# EAGLE design oktosema (EAGLE 6.5.0)
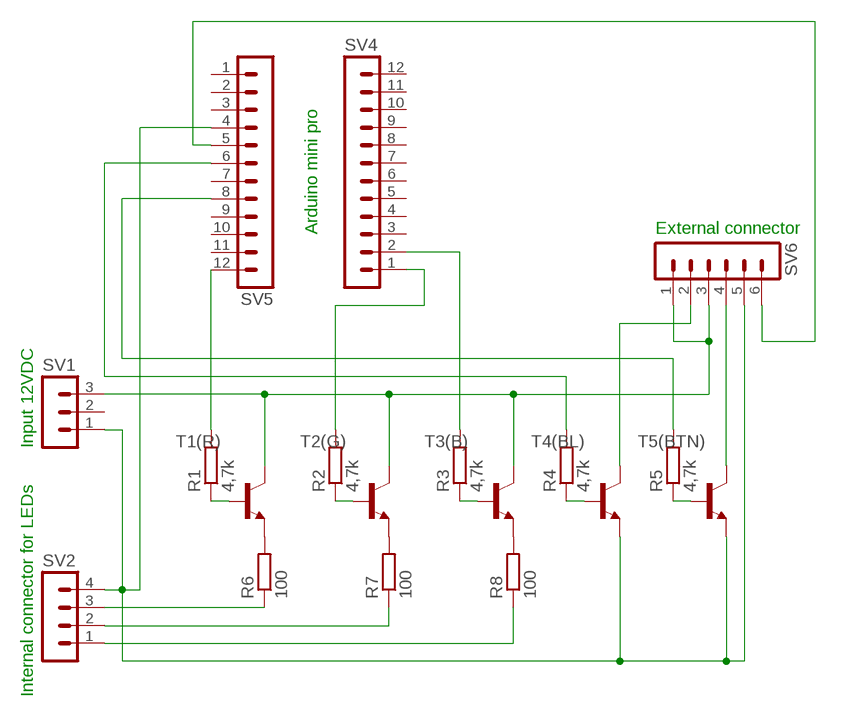
[diagram p0: schematic, sheet 1]

## Parts
R1  4,7k  R-EU_0204/7  [0204/7]
R2  4,7k  R-EU_0204/7  [0204/7]
R3  4,7k  R-EU_0204/7  [0204/7]
R4  4,7k  R-EU_0204/7  [0204/7]
R5  4,7k  R-EU_0204/7  [0204/7]
R6  100  R-EU_0204/7  [0204/7]
R7  100  R-EU_0204/7  [0204/7]
R8  100  R-EU_0204/7  [0204/7]
SV1  MA03-1  [MA03-1]
SV2  MA04-1  [MA04-1]
SV4  MA12-1  [MA12-1]
SV5  MA12-1  [MA12-1]
SV6  MA06-1  [MA06-1]
T1(R)  BC337-25-NPN-TO92-CBE  [TO92-CBE]
T2(G)  BC337-25-NPN-TO92-CBE  [TO92-CBE]
T3(B)  BC337-25-NPN-TO92-CBE  [TO92-CBE]
T4(BL)  BC337-25-NPN-TO92-CBE  [TO92-CBE]
T5(BTN)  BC337-25-NPN-TO92-CBE  [TO92-CBE]

## Nets
N$1: R1.1 T1(R).B
N$2: R2.1 T2(G).B
N$3: R3.1 T3(B).B
N$4: R4.1 T4(BL).B
N$5: R5.1 T5(BTN).B
N$6: R1.2 SV5.12
N$7: R2.2 SV4.1
N$8: R3.2 SV4.2
N$9: R4.2 SV5.6
N$10: R5.2 SV5.8
N$11: SV1.3 SV6.1 SV6.3 T1(R).C T2(G).C T3(B).C
N$12: R6.2 T1(R).E
N$13: R7.2 T2(G).E
N$14: R8.2 T3(B).E
N$15: SV6.4 T5(BTN).C
N$16: R8.1 SV2.1
N$18: R6.1 SV2.3
N$19: R7.1 SV2.2
N$20: SV6.2 T4(BL).C
N$21: SV5.5 SV6.6
N$22: SV1.1 SV2.4 SV5.4 SV6.5 T4(BL).E T5(BTN).E
Unconnected: SV1.2 SV4.3 SV4.4 SV4.5 SV4.6 SV4.7 SV4.8 SV4.9 SV4.10 SV4.11 SV4.12 SV5.1 SV5.2 SV5.3 SV5.7 SV5.9 SV5.10 SV5.11

## Notes on the sheet
- Arduino mini pro | External connector
- Input 12VDC
- Internal connector for LEDs

## Library data of the parts
R1-R8 = resistor:R-EU_: RESISTOR, European symbol; OC_NEWARK: unknown
SV1 = con-lstb:MA03-1: PIN HEADER; OC_FARNELL: unknown; OC_NEWARK: unknown
SV2 = con-lstb:MA04-1: PIN HEADER; OC_FARNELL: unknown; OC_NEWARK: unknown
SV4 SV5 = con-lstb:MA12-1: PIN HEADER; OC_FARNELL: unknown; OC_NEWARK: unknown
SV6 = con-lstb:MA06-1: PIN HEADER; OC_FARNELL: unknown; OC_NEWARK: unknown
T1(R) T2(G) T3(B) T4(BL) T5(BTN) = transistor:*-NPN-: NPN Transistror BF959 corrected 2008.03.06; OC_NEWARK: unknown

## Board
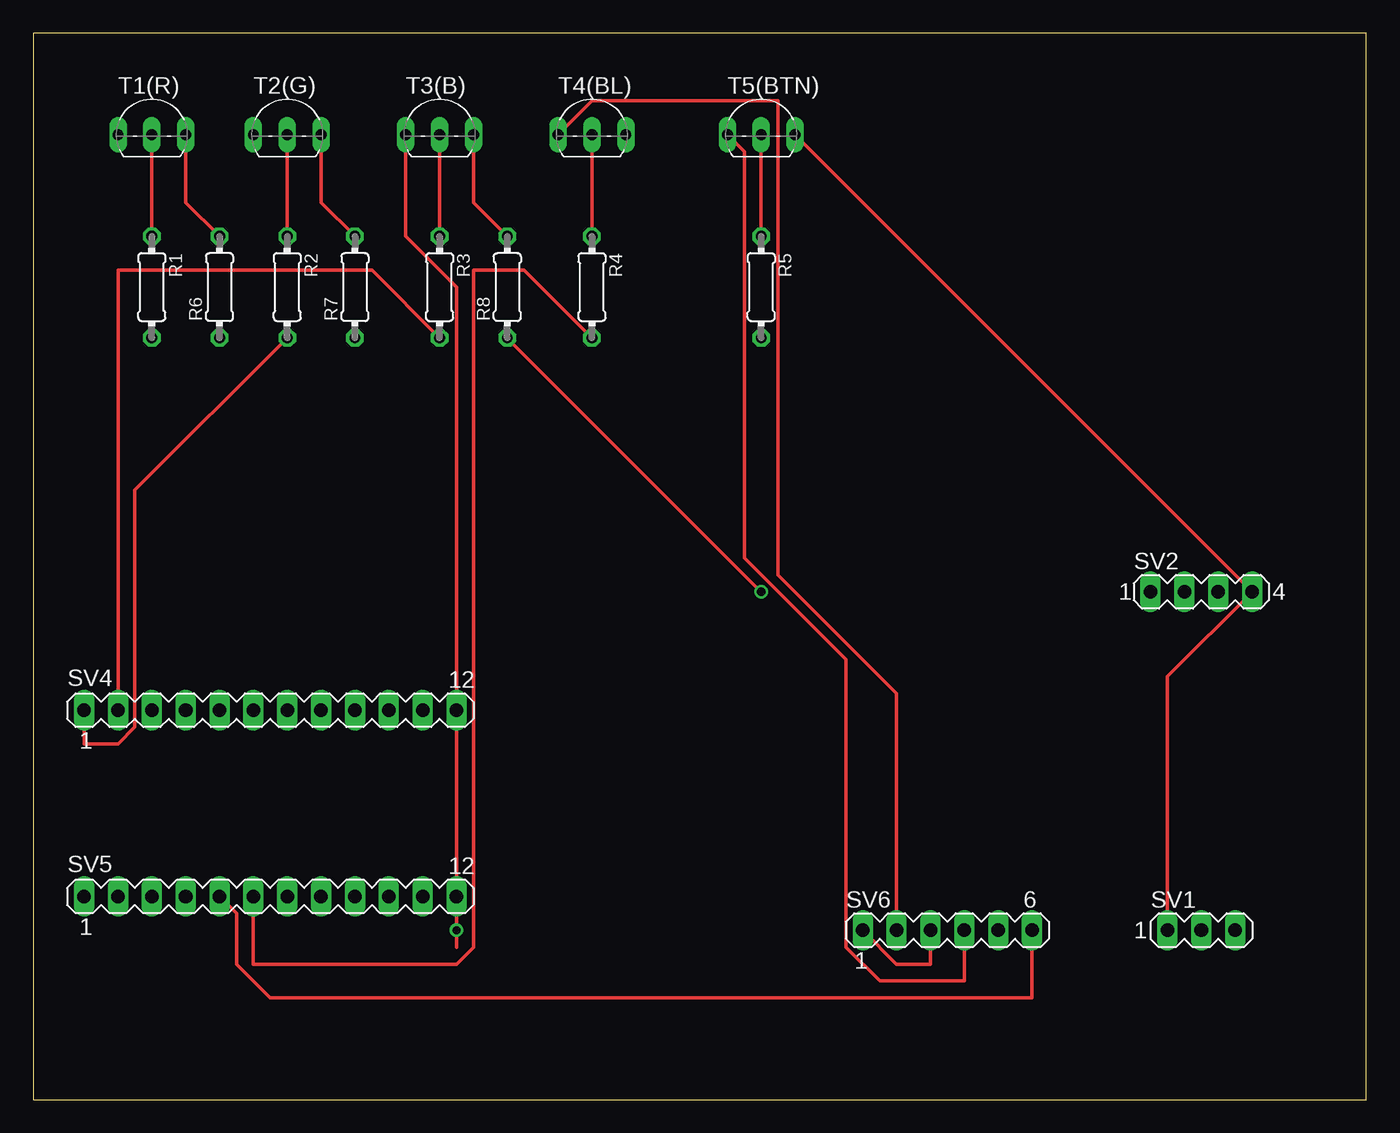
[diagram p1: board, top side]
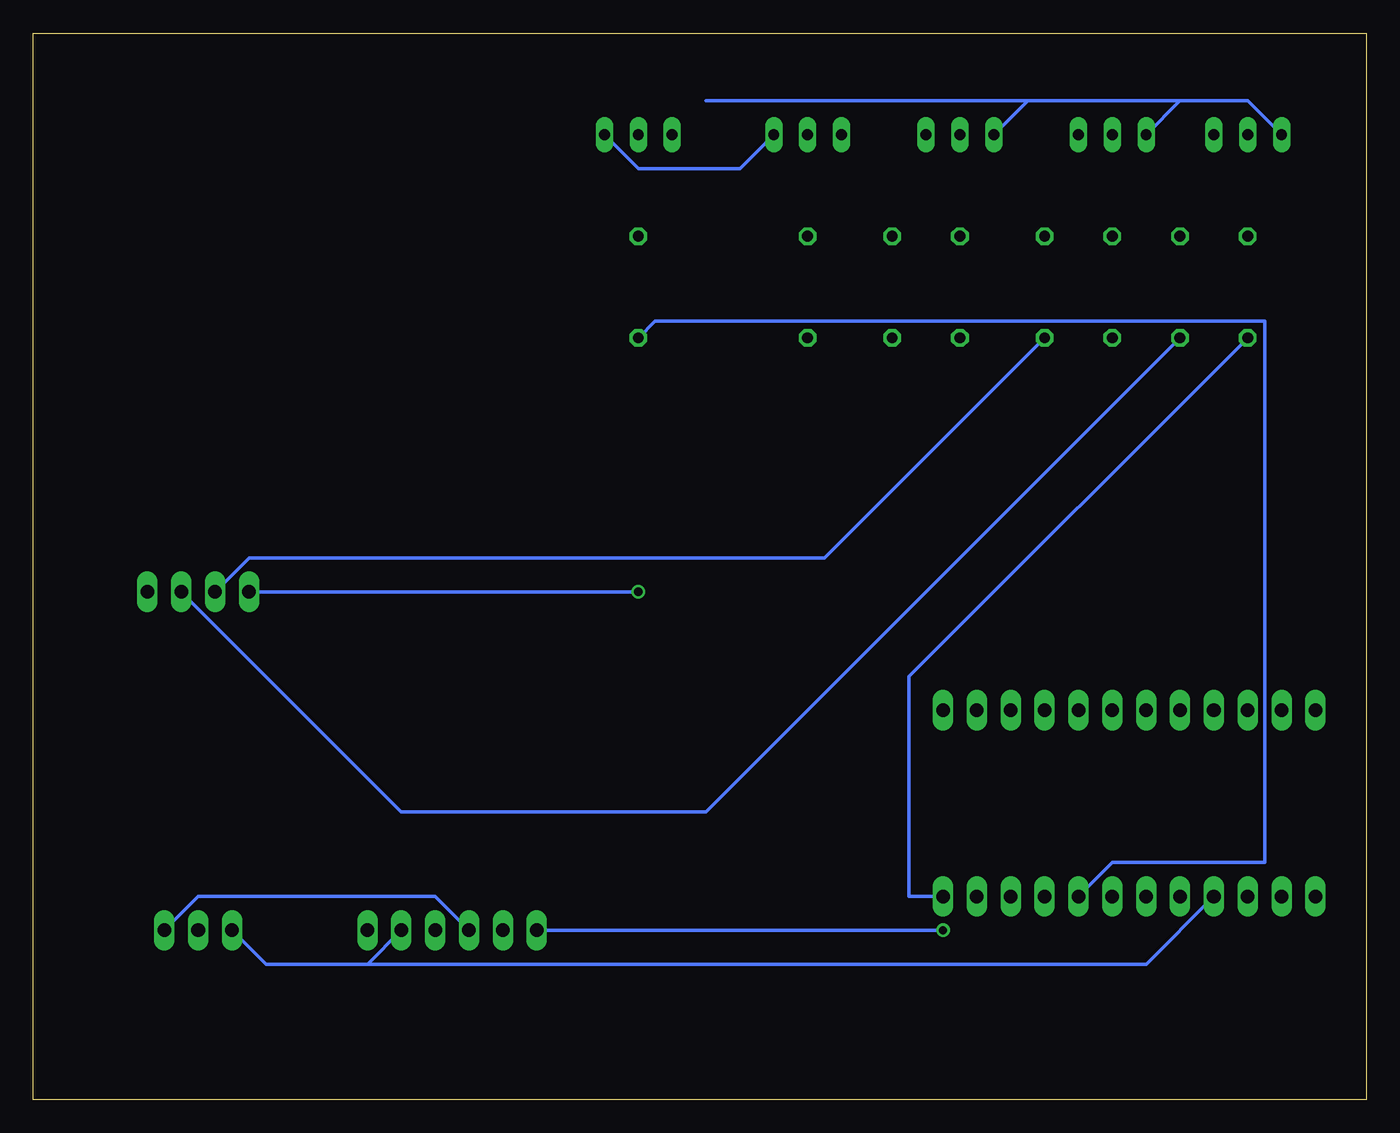
[diagram p2: board, bottom side, seen from below]

Size 100 x 80 mm. Coordinates in mm from the lower left corner, seen from the top.
Outline: 0,0 100,0 100,80 0,80 0,0
Copper layers (1*16): Top 0.035mm / dielectric 1.5mm / Bottom 0.035mm
Design rules "default": minimum track width 10mil, minimum drill 24mil, track to track 8mil, track to pad 8mil, pad to pad 8mil, via to via 8mil, smd to smd 8mil, copper to edge 40mil, drill to drill 8mil, minimum pad ring 10mil, minimum via ring 8mil, stop-mask expansion 4mil, vias tented up to drill 0mil, thermal gap 10mil

### Footprints (pad centres in the part's own frame; a part is rotated, then mirrored left to right if it is on the bottom)
0204/7 = drill 0.813 octagon: 1 -3.81,0; 2 3.81,0
MA03-1 = drill 1.016 long: 1 -2.54,0; 2 0,0; 3 2.54,0
MA04-1 = drill 1.016 long: 1 -3.81,0; 2 -1.27,0; 3 1.27,0; 4 3.81,0
MA12-1 = drill 1.016 long: 1 -13.97,0; 2 -11.43,0; 3 -8.89,0; 4 -6.35,0; 5 -3.81,0; 6 -1.27,0; 7 1.27,0; 8 3.81,0; 9 6.35,0; 10 8.89,0; 11 11.43,0; 12 13.97,0
MA06-1 = drill 1.016 long: 1 -6.35,0; 2 -3.81,0; 3 -1.27,0; 4 1.27,0; 5 3.81,0; 6 6.35,0
TO92-CBE = drill 0.813 long: B 0,0; C -2.54,0; E 2.54,0

### Placement (x,y rotation side)
R1  8.89,60.96 270 top
R2  19.05,60.96 270 top
R3  30.48,60.96 270 top
R4  41.91,60.96 270 top
R5  54.61,60.96 270 top
R6  13.97,60.96 90 top
R7  24.13,60.96 90 top
R8  35.56,60.96 90 top
SV1  87.63,12.7 0 top
SV2  87.63,38.1 0 top
SV4  17.78,29.21 0 top
SV5  17.78,15.24 0 top
SV6  68.58,12.7 0 top
T1(R)  8.89,72.39 0 top
T2(G)  19.05,72.39 0 top
T3(B)  30.48,72.39 0 top
T4(BL)  41.91,72.39 0 top
T5(BTN)  54.61,72.39 0 top

### Tracks (layer width: path | path; a pad name or v marks a point on that pad's centre or on a via)
N$1
  Top 0.254: T1(R).B R1.1
N$2
  Top 0.254: T2(G).B R2.1
N$3
  Top 0.254: T3(B).B R3.1
N$4
  Top 0.254: T4(BL).B R4.1
N$5
  Top 0.254: T5(BTN).B R5.1
N$6
  Bottom 0.254: R1.2 34.29,31.75 34.29,15.24 SV5.12
N$7
  Top 0.254: R2.2 7.62,45.72 7.62,27.94 6.35,26.67 3.81,26.67 SV4.1
N$8
  Top 0.254: R3.2 25.4,62.23 6.35,62.23 SV4.2
N$9
  Top 0.254: R4.2 36.83,62.23 33.02,62.23 33.02,11.43 31.75,10.16 16.51,10.16 SV5.6
N$10
  Bottom 0.254: R5.2 53.34,58.42 7.62,58.42 7.62,17.78 19.05,17.78 SV5.8
N$11  (via drill 0.61)
  Top 0.254: 31.75,11.43 v31.75,12.7 31.75,60.96 27.94,64.77 T3(B).C | SV6.1 64.77,10.16 67.31,10.16 SV6.3
  Bottom 0.254: T1(R).C 8.89,74.93 13.97,74.93 | T2(G).C 13.97,74.93 | 25.4,74.93 T3(B).C | 13.97,74.93 25.4,74.93 | 25.4,74.93 49.53,74.93 | SV1.3 87.63,15.24 69.85,15.24 SV6.3 | v31.75,12.7 SV6.1
N$12
  Top 0.254: R6.2 11.43,67.31 T1(R).E
N$13
  Top 0.254: R7.2 21.59,67.31 T2(G).E
N$14
  Top 0.254: R8.2 33.02,67.31 T3(B).E
N$15
  Top 0.254: T5(BTN).C 53.34,71.12 53.34,40.64 60.96,33.02 60.96,11.43 63.5,8.89 69.85,8.89 SV6.4
N$16  (via drill 0.61)
  Top 0.254: v54.61,38.1 R8.1
  Bottom 0.254: v54.61,38.1 SV2.1
N$18
  Bottom 0.254: R6.1 49.53,21.59 72.39,21.59 SV2.3
N$19
  Bottom 0.254: R7.1 40.64,40.64 83.82,40.64 SV2.2
N$20
  Top 0.254: T4(BL).C 41.91,74.93 55.88,74.93 55.88,39.37 64.77,30.48 SV6.2
N$21
  Top 0.254: SV5.5 15.24,13.97 15.24,10.16 17.78,7.62 74.93,7.62 SV6.6
N$22
  Top 0.254: SV1.1 85.09,31.75 SV2.4 T5(BTN).E
  Bottom 0.254: T4(BL).E 46.99,69.85 54.61,69.85 T5(BTN).E | 74.93,10.16 SV6.5 | 74.93,10.16 82.55,10.16 SV1.1 | SV5.4 16.51,10.16 74.93,10.16